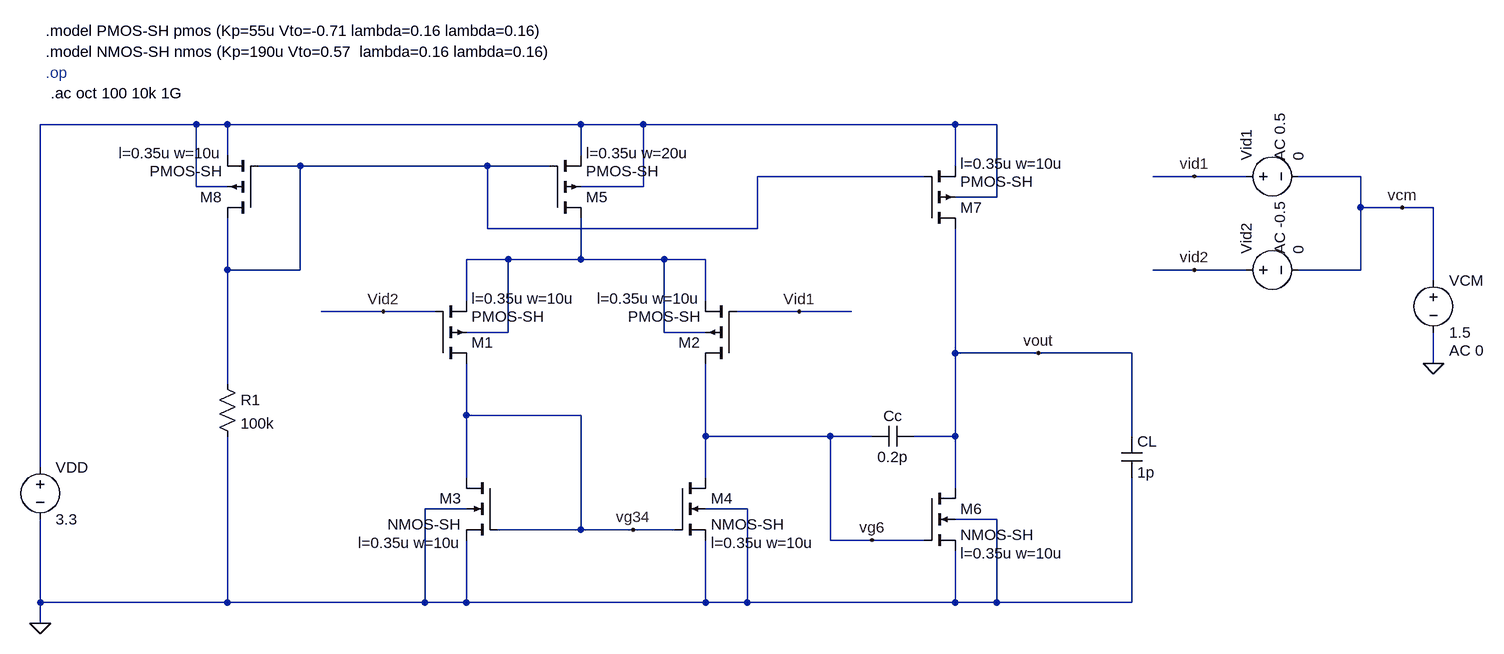
[diagram p0: schematic 1_pmos_opamp_miller.asc]
1_pmos_opamp_miller.asc, the LTspice schematic file:
Version 4
SHEET 1 1924 1124
WIRE -960 -64 -1200 -64
WIRE -912 -64 -960 -64
WIRE -368 -64 -912 -64
WIRE -272 -64 -368 -64
WIRE 208 -64 -272 -64
WIRE 272 -64 208 -64
WIRE -912 -16 -912 -64
WIRE -368 -16 -368 -64
WIRE -800 0 -864 0
WIRE -512 0 -800 0
WIRE -416 0 -512 0
WIRE 208 0 208 -64
WIRE 160 16 -96 16
WIRE 576 16 512 16
WIRE 656 16 576 16
WIRE 832 16 736 16
WIRE -960 32 -960 -64
WIRE -912 32 -960 32
WIRE -272 32 -272 -64
WIRE -272 32 -368 32
WIRE 272 48 272 -64
WIRE 272 48 208 48
WIRE 832 64 832 16
WIRE 896 64 832 64
WIRE 944 64 896 64
WIRE -512 96 -512 0
WIRE -96 96 -96 16
WIRE -96 96 -512 96
WIRE -480 144 -544 144
WIRE -368 144 -368 80
WIRE -368 144 -480 144
WIRE -240 144 -368 144
WIRE -176 144 -240 144
WIRE -912 160 -912 80
WIRE -800 160 -800 0
WIRE -800 160 -912 160
WIRE 576 160 512 160
WIRE 656 160 576 160
WIRE 832 160 832 64
WIRE 832 160 736 160
WIRE 944 176 944 64
WIRE -544 208 -544 144
WIRE -176 208 -176 144
WIRE -672 224 -768 224
WIRE -592 224 -672 224
WIRE -32 224 -128 224
WIRE 48 224 -32 224
WIRE -480 256 -480 144
WIRE -480 256 -544 256
WIRE -240 256 -240 144
WIRE -176 256 -240 256
WIRE 208 288 208 96
WIRE 336 288 208 288
WIRE 480 288 336 288
WIRE 944 304 944 256
WIRE -912 336 -912 160
WIRE -544 384 -544 304
WIRE -368 384 -544 384
WIRE -176 416 -176 304
WIRE 16 416 -176 416
WIRE 80 416 16 416
WIRE 208 416 208 288
WIRE 208 416 144 416
WIRE 480 416 480 288
WIRE -1200 464 -1200 -64
WIRE -544 480 -544 384
WIRE -176 480 -176 416
WIRE 208 496 208 416
WIRE -544 528 -608 528
WIRE -112 528 -176 528
WIRE 272 544 208 544
WIRE -368 560 -368 384
WIRE -368 560 -496 560
WIRE -288 560 -368 560
WIRE -224 560 -288 560
WIRE 16 576 16 416
WIRE 80 576 16 576
WIRE 160 576 80 576
WIRE -1200 672 -1200 544
WIRE -912 672 -912 416
WIRE -912 672 -1200 672
WIRE -608 672 -608 528
WIRE -608 672 -912 672
WIRE -544 672 -544 576
WIRE -544 672 -608 672
WIRE -176 672 -176 576
WIRE -176 672 -544 672
WIRE -112 672 -112 528
WIRE -112 672 -176 672
WIRE 208 672 208 592
WIRE 208 672 -112 672
WIRE 272 672 272 544
WIRE 272 672 208 672
WIRE 480 672 480 480
WIRE 480 672 272 672
WIRE -1200 704 -1200 672
FLAG -1200 704 0
FLAG 944 304 0
FLAG 576 16 vid1
FLAG 576 160 vid2
FLAG 896 64 vcm
FLAG -32 224 Vid1
FLAG -672 224 Vid2
FLAG 336 288 vout
FLAG -288 560 vg34
FLAG 80 576 vg6
DATAFLAG 16 512 ""
DATAFLAG 240 288 ""
DATAFLAG 64 16 ""
SYMBOL voltage -1200 448 R0
WINDOW 123 0 0 Left 2
WINDOW 39 0 0 Left 2
SYMATTR InstName VDD
SYMATTR Value 3.3
SYMBOL voltage 944 160 R0
WINDOW 123 24 124 Left 2
WINDOW 39 0 0 Left 2
SYMATTR Value2 AC 0
SYMATTR InstName VCM
SYMATTR Value 1.5
SYMBOL voltage 640 16 R270
WINDOW 123 24 68 Left 2
WINDOW 39 0 0 Left 2
SYMATTR Value2 AC 0.5
SYMATTR InstName Vid1
SYMATTR Value 0
SYMBOL voltage 640 160 R270
WINDOW 123 24 68 Left 2
WINDOW 39 0 0 Left 2
SYMATTR Value2 AC -0.5
SYMATTR InstName Vid2
SYMATTR Value 0
SYMBOL cap 464 416 R0
SYMATTR InstName CL
SYMATTR Value 1p
SYMBOL pmos4 -592 304 M180
WINDOW 123 56 100 Left 2
SYMATTR Value2 l=0.35u w=10u
SYMATTR InstName M1
SYMATTR Value PMOS-SH
SYMBOL pmos4 -128 304 R180
WINDOW 123 56 100 Left 2
SYMATTR Value2 l=0.35u w=10u
SYMATTR InstName M2
SYMATTR Value PMOS-SH
SYMBOL pmos4 -416 80 M180
WINDOW 123 56 100 Left 2
SYMATTR Value2 l=0.35u w=20u
SYMATTR InstName M5
SYMATTR Value PMOS-SH
SYMBOL nmos4 -496 480 M0
WINDOW 123 56 100 Left 2
SYMATTR Value2 l=0.35u w=10u
SYMATTR InstName M3
SYMATTR Value NMOS-SH
SYMBOL nmos4 -224 480 R0
WINDOW 123 56 100 Left 2
SYMATTR Value2 l=0.35u w=10u
SYMATTR InstName M4
SYMATTR Value NMOS-SH
SYMBOL nmos4 160 496 R0
WINDOW 123 56 100 Left 2
SYMATTR Value2 l=0.35u w=10u
SYMATTR InstName M6
SYMATTR Value NMOS-SH
SYMBOL pmos4 160 96 M180
WINDOW 123 56 100 Left 2
SYMATTR Value2 l=0.35u w=10u
SYMATTR InstName M7
SYMATTR Value PMOS-SH
SYMBOL pmos4 -864 80 R180
WINDOW 123 56 100 Left 2
SYMATTR Value2 l=0.35u w=10u
SYMATTR InstName M8
SYMATTR Value PMOS-SH
SYMBOL cap 80 432 R270
WINDOW 0 32 32 VTop 2
WINDOW 3 0 32 VBottom 2
SYMATTR InstName Cc
SYMATTR Value 0.2p
SYMBOL res -928 320 R0
SYMATTR InstName R1
SYMATTR Value 100k
TEXT -1192 -176 Left 2 !.model NMOS-SH nmos (Kp=190u Vto=0.57  lambda=0.16 lambda=0.16)
TEXT -1192 -144 Left 2 ;.op
TEXT -1192 -208 Left 2 !.model PMOS-SH pmos (Kp=55u Vto=-0.71 lambda=0.16 lambda=0.16)
TEXT -1184 -112 Left 2 !.ac oct 100 10k 1G

The netlist it stands for:
* 1_pmos_opamp_miller.asc
VDD N001 0 3.3
VCM vcm 0 1.5 AC 0
Vid1 vid1 vcm 0 AC 0.5
Vid2 vid2 vcm 0 AC -0.5
CL vout 0 1p
M1 vg34 vid2 N003 N003 PMOS-SH l=0.35u w=10u
M2 vg6 vid1 N003 N003 PMOS-SH l=0.35u w=10u
M5 N003 N002 N001 N001 PMOS-SH l=0.35u w=20u
M3 vg34 vg34 0 0 NMOS-SH l=0.35u w=10u
M4 vg6 vg34 0 0 NMOS-SH l=0.35u w=10u
M6 vout vg6 0 0 NMOS-SH l=0.35u w=10u
M7 vout N002 N001 N001 PMOS-SH l=0.35u w=10u
M8 N002 N002 N001 N001 PMOS-SH l=0.35u w=10u
Cc vg6 vout 0.2p
R1 N002 0 100k
.model NMOS NMOS
.model PMOS PMOS
.lib standard.mos
.model NMOS-SH nmos (Kp=190u Vto=0.57  lambda=0.16 lambda=0.16)
* .op
.model PMOS-SH pmos (Kp=55u Vto=-0.71 lambda=0.16 lambda=0.16)
.ac oct 100 10k 1G
.backanno
.end